# EAGLE design kctlspi (EAGLE 6.4)
AUTHOR_NAME: kps; PROJECT_NAME: Split keyboard; VERSION: 20130907
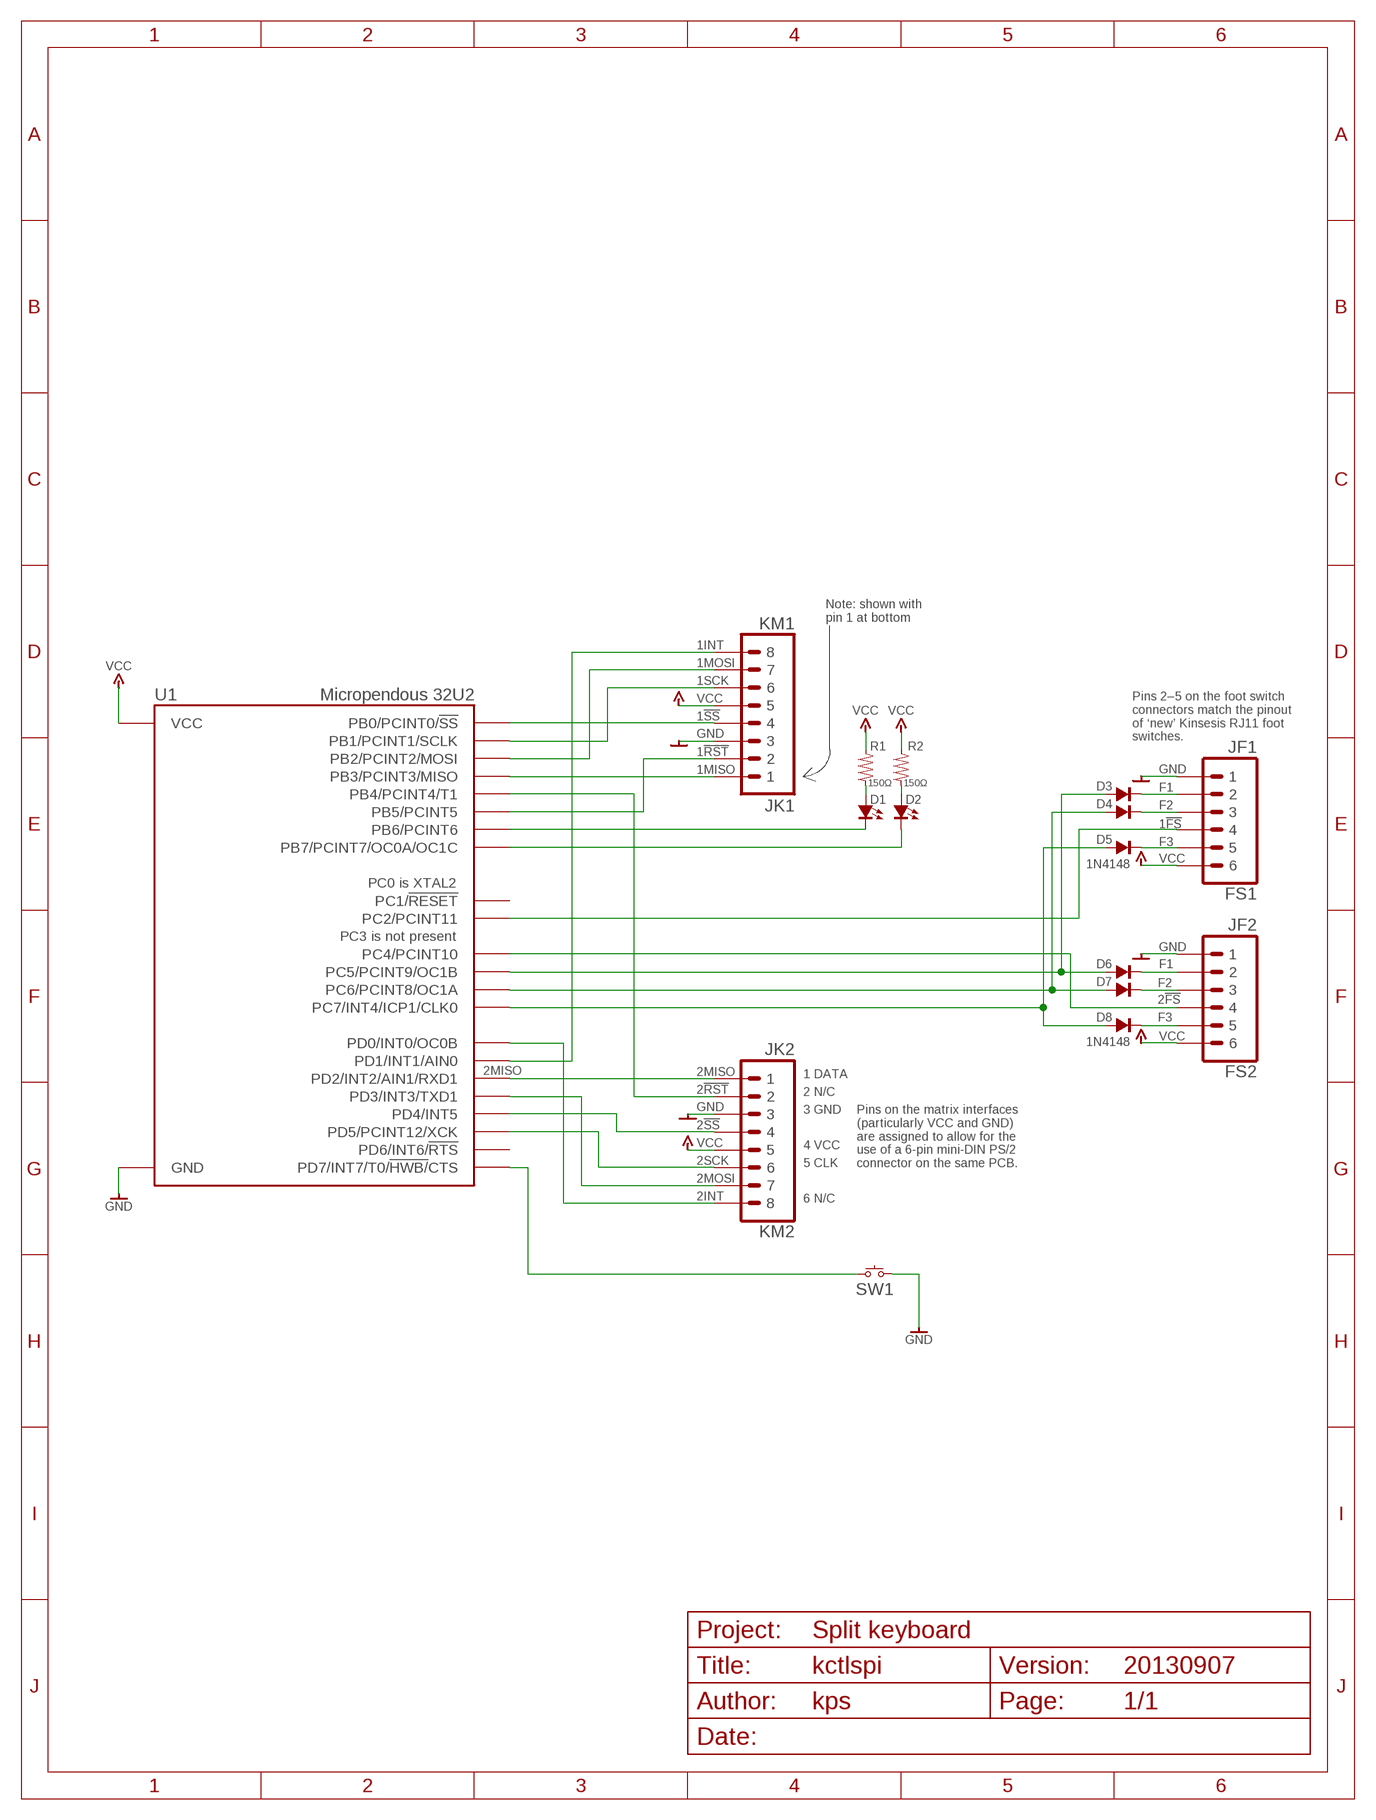
[diagram p0: schematic, sheet 1]

## Parts
D1  LED  [2H-100-P-EXTSS]
D2  LED  [2H-100-P-EXTSS]
D3  1N4148  DIODE-300-SMALLSS  [2H-300-P-SMALLSS]
D4  1N4148  DIODE-300-SMALLSS  [2H-300-P-SMALLSS]
D5  1N4148  DIODE-300-SMALLSS  [2H-300-P-SMALLSS]
D6  1N4148  DIODE-300-SMALLSS  [2H-300-P-SMALLSS]
D7  1N4148  DIODE-300-SMALLSS  [2H-300-P-SMALLSS]
D8  1N4148  DIODE-300-SMALLSS  [2H-300-P-SMALLSS]
JF1  FS1  J-6-RJ12-LP  [J-8-RJ12-TE5555163]
JF2  FS2  J-6-RJ12-LP  [J-8-RJ12-TE5555163]
JK1  KM1  J-8-SHIELD-MINIDIN  [J-8-MINIDIN-KMD11]
JK2  KM2  J-8-SHIELD-MINIDIN  [J-8-MINIDIN-KMD11]
R1  150Ω  RESISTOR-300  [2H-300-N-NOSS]
R2  150Ω  RESISTOR-300  [2H-300-N-NOSS]
SW1  SW-TACTILE-RA  [SW-TACTILE-RA]
U1  Micropendous 32U2  IC-ATMEGA32U2-NOOGROOVE  [IC-ATMEGA32U2-NOOGROOVE]

## Nets
1!FS: JF1.4 U1.PC2(PC2/PCINT11)
1!RST: JK1.2 U1.PB5(PB5/PCINT5)
1!SS: JK1.4 U1.PB0(PB0/PCINT0/!SS)
1INT: JK1.8 U1.PD1(PD1/INT1/AIN0)
1MISO: JK1.1 U1.PB3(PB3/PCINT3/MISO)
1MOSI: JK1.7 U1.PB2(PB2/PCINT2/MOSI)
1SCK: JK1.6 U1.PB1(PB1/PCINT1/SCLK)
2!FS: JF2.4 U1.PC4(PC4/PCINT10)
2!RST: JK2.2 U1.PB4(PB4/PCINT4/T1)
2!SS: JK2.4 U1.PD4(PD4/INT5)
2INT: JK2.8 U1.PD0(PD0/INT0/OC0B)
2MISO: JK2.1 U1.PD2(PD2/INT2/AIN1/RXD1)
2MOSI: JK2.7 U1.PD3(PD3/INT3/TXD1)
2SCK: JK2.6 U1.PD5(PD5/PCINT12/XCK)
F1: D3.A D6.A U1.PC5(PC5/PCINT9/OC1B)
F2: D4.A D7.A U1.PC6(PC6/PCINT8/OC1A)
F3: D5.A D8.A U1.PC7(PC7/INT4/ICP1/CLK0)
GND: JF1.1 JF2.1 JK1.3 JK2.3 SW1.2 U1.GND
LED1: D1.C U1.PB6(PB6/PCINT6)
LED2: D2.C U1.PB7(PB7/PCINT7/OC0A/OC1C)
N$1: SW1.1 U1.PD7(PD7/INT7/T0/!HWB/!CTS)
N$2: D3.C JF1.2
N$3: D4.C JF1.3
N$4: D5.C JF1.5
N$5: D8.C JF2.5
N$6: D7.C JF2.3
N$7: D6.C JF2.2
N$20: D2.A R2.1
N$21: D1.A R1.1
VCC: JF1.6 JF2.6 JK1.5 JK2.5 R1.2 R2.2 U1.+5V(VCC)
Unconnected: U1.PD6(PD6/INT6/!RTS) U1.RESET(PC1/!RESET)

## Notes on the sheet
- Note: shown with
  pin 1 at bottom
- Pins 2–5 on the foot switch
  connectors match the pinout
  of ‘new’ Kinsesis RJ11 foot
  switches.
- 1 DATA
- 2 N/C
- 3 GND
- 4 VCC
- 5 CLK
- Pins on the matrix interfaces
  (particularly VCC and GND)
  are assigned to allow for the
  use of a 6-pin mini-DIN PS/2
  connector on the same PCB.
- 6 N/C

## Power pins joined to a net without a drawn wire
GND: JK1.GND JK2.GND SW1.3(GND) SW1.4(GND)

## Library data of the parts
D1 D2 = misc:LED
D3-D8 = misc:DIODE
JF1 JF2 = conn:J-6: 6 pin connector
JK1 JK2 = conn:J-8-SHIELD
R1 R2 = misc:RESISTOR
SW1 = switch:SW-TACTILE-RA
U1 = ic:IC-ATMEGA32U2-NOOGROOVE: NooGroove ATmega32U2 development board.

## Board
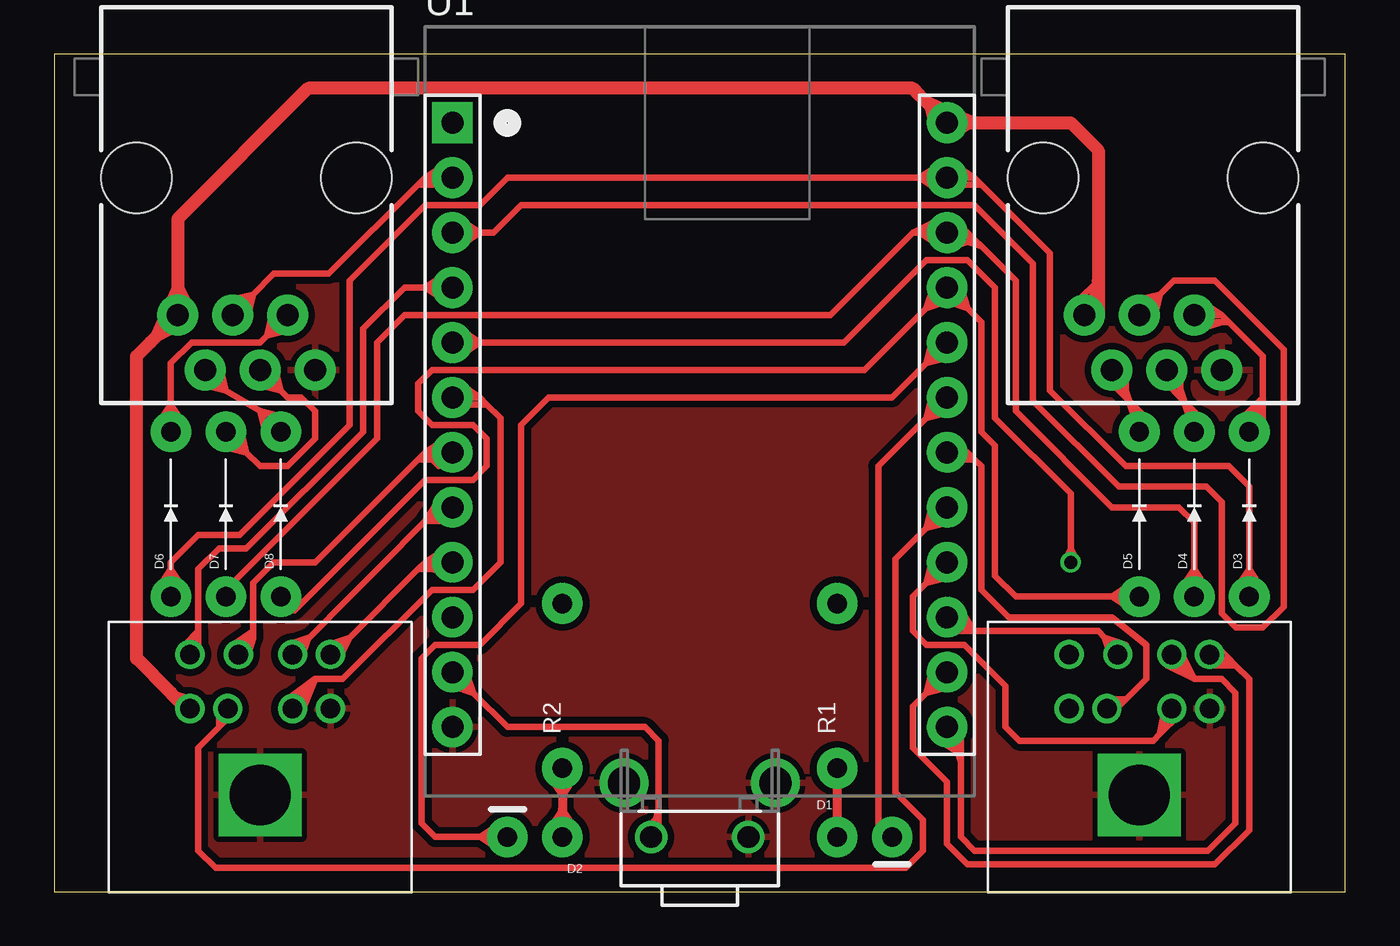
[diagram p1: board, top side]
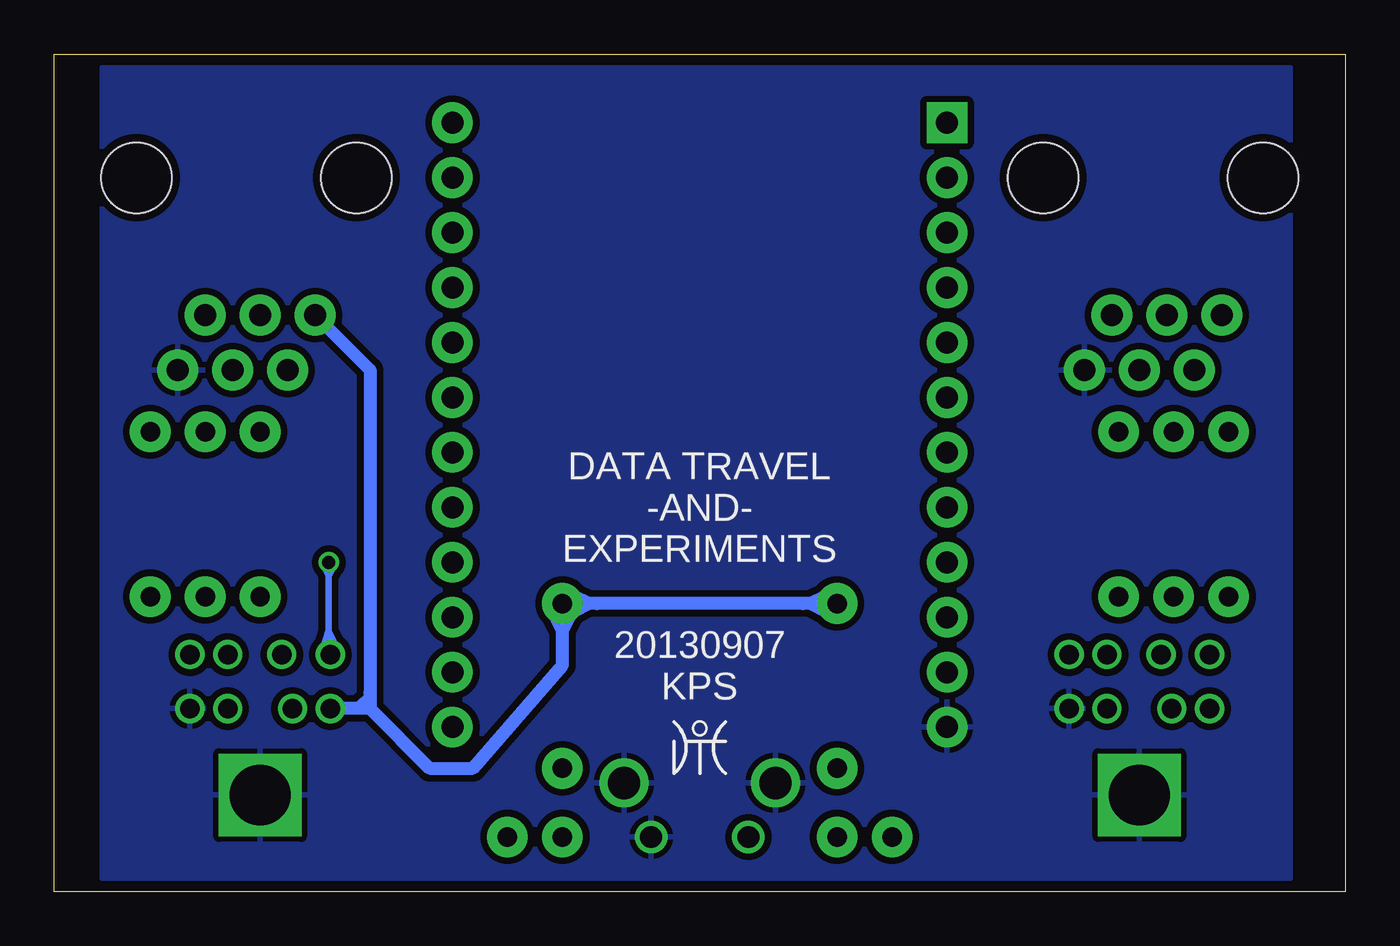
[diagram p2: board, bottom side, seen from below]

Size 59.69 x 38.73 mm. Coordinates in mm from the lower left corner, seen from the top.
Outline: 0,0 59.69,0 59.69,38.73 0,38.73 0,0
Copper layers (1*16): Top 0.0356mm / dielectric 1.5011mm / Bottom 0.0356mm
Design rules "LaenPCBOrder": minimum track width 6mil, minimum drill 13mil, track to track 6mil, track to pad 6mil, pad to pad 6mil, via to via 6mil, smd to smd 6mil, copper to edge 15mil, drill to drill 6mil, minimum pad ring 7mil, minimum via ring 7mil, stop-mask expansion 4mil, vias tented up to drill 0mil, thermal gap 10mil

### Footprints (pad centres in the part's own frame; a part is rotated, then mirrored left to right if it is on the bottom)
2H-100-P-EXTSS = drill 0.9 pad 1.88: A -1.27,0; C 1.27,0
2H-300-P-SMALLSS = drill 0.9 pad 1.88: A -3.81,0; C 3.81,0
J-8-RJ12-TE5555163 = drill 1.016 pad 1.88: 1 -3.175,7.62; 2 -1.905,5.08; 3 -0.635,7.62; 4 0.635,5.08; 5 1.905,7.62; 6 3.175,5.08 | hole 3.251: -5.08,-1.27; 5.08,-1.27
J-8-MINIDIN-KMD11 = drill 0.9: 1 1.5,0; 2 -1.5,0; 3 3.25,0; 4 1.5,2.5; 5 -3.25,0; 6 3.25,2.5; 7 -1,2.5; 8 -3.25,2.5 | drill 2.8 pad 3.81 square: GND 0,-4
2H-300-N-NOSS = drill 0.9 pad 1.88: 1 -3.81,0; 2 3.81,0
SW-TACTILE-RA = drill 1: 1 -2.25,-1.27; 2 2.25,-1.27 | drill 1.5: 3 -3.5,1.23; 4 3.5,1.23
IC-ATMEGA32U2-NOOGROOVE = drill 1.016 pad 1.88: +5V 11.43,13.97; GND -11.43,-13.97; PB0 11.43,-13.97; PB1 11.43,-11.43; PB2 11.43,-8.89; PB3 11.43,-6.35; PB4 11.43,-3.81; PB5 11.43,-1.27; PB6 11.43,1.27; PB7 11.43,3.81; PC2 -11.43,8.89; PC4 -11.43,11.43; PC5 11.43,11.43; PC6 11.43,8.89; PC7 11.43,6.35; PD0 -11.43,6.35; PD1 -11.43,3.81; PD2 -11.43,1.27; PD3 -11.43,-1.27; PD4 -11.43,-3.81; PD5 -11.43,-6.35; PD6 -11.43,-8.89; PD7 -11.43,-11.43 | drill 1.016 pad 1.88 square: RESET -11.43,13.97

### Placement (x,y rotation side)
D1  37.47,2.54 0 top
D2  22.23,2.54 180 top
D3  55.24,17.46 90 top
D4  52.7,17.46 90 top
D5  50.16,17.46 90 top
D6  5.4,17.46 90 top
D7  7.94,17.46 90 top
D8  10.48,17.46 90 top
JF1  50.8,31.75 180 top
JF2  8.89,31.75 180 top
JK1  50.16,8.48 0 top
JK2  9.53,8.48 0 top
R1  36.2,9.53 90 top
R2  23.5,9.53 90 top
SW1  29.84,3.81 0 top
U1  29.84,21.59 0 top
U$2  [GLYPH-DT&E-100]  29.84,6.67 0 bottom

### Tracks (layer width: path | path; a pad name or v marks a point on that pad's centre or on a via)
1!FS
  Top 0.305: JF1.4 51.12,27.62 | 51.12,27.62 51.75,28.26 53.66,28.26 56.83,25.08 56.83,13.18 55.88,12.22 54.63,12.22 53.98,12.88 53.98,18.02 53.27,18.73 49.21,18.73 45.24,22.7 45.24,29.05 42.55,31.75 21.59,31.75 20.32,30.48 19.68,30.48 | 19.68,30.48 U1.PC2 | 18.73,31.11 19.68,30.48 | 19.68,30.48 18.73,29.85 | 49.85,27.31 51.12,27.62 | 51.12,27.62 50.8,26.35
1!RST
  Top 0.305: JK1.2 48.9,8.25 49.53,8.89 | 49.53,8.89 50.48,9.84 50.48,11.43 48.9,12.7 44.13,12.7 42.86,13.97 42.86,19.68 42.55,20 | 42.55,20 42.23,20.32 | 42.23,20.32 U1.PB5 | 41.59,20.96 42.23,20.32 | 42.55,20 41.91,20 | 48.58,8.89 49.53,8.89
1!SS
  Top 0.305: 41.91,6.03 41.91,2.54 42.55,1.91 53.34,1.91 54.61,3.18 54.61,9.21 53.98,9.84 52.7,9.84 | 41.91,6.03 41.91,6.35 | 41.91,6.35 41.91,7.62 U1.PB0 | 40.96,6.99 41.91,6.35 | 41.59,6.99 41.91,6.03 | 52.7,9.84 51.44,10.48 51.44,10.75 JK1.4 | 52.7,9.84 52.07,11.11 52.07,10.48 52.7,9.84
1INT  (via drill 0.6)
  Top 0.305: U1.PD1 19.68,25.4 | 19.68,25.4 36.51,25.4 40.32,29.21 42.23,29.21 43.5,27.94 43.5,21.91 46.99,18.42 46.99,15.88 | 46.99,15.88 v46.99,15.24 | 18.73,24.77 19.68,25.4 | 19.68,25.4 18.73,26.04 | 46.67,15.24 46.99,15.88 | 46.99,15.88 47.31,15.24
  Bottom 0.305: JK1.8 46.99,11.11 46.99,12.07 | 46.99,12.07 46.99,14.61 | 46.99,14.61 v46.99,15.24 | 47.31,11.11 46.99,12.07 | 46.99,12.07 46.67,11.43 | 46.67,15.24 46.99,14.61 | 46.99,14.61 47.31,15.24
1MISO
  Top 0.305: U1.PB3 40.32,14.29 | 40.32,14.29 39.69,13.65 39.69,12.07 40.32,11.43 42.07,11.43 43.97,9.53 43.97,7.62 44.61,6.99 50.8,6.99 51.12,7.3 | 51.12,7.3 51.98,8.17 JK1.1 | 40.64,15.56 40.32,14.29 | 40.32,14.29 41.59,14.61 | 51.12,7.3 51.44,8.89 | 51.12,7.3 51.75,8.57
1MOSI
  Top 0.305: U1.PB2 41.91,12.07 | 41.91,12.07 42.23,12.07 | 42.23,12.07 42.55,12.07 | 42.55,12.07 48.26,12.07 48.58,11.75 | 48.58,11.75 49.16,11.16 JK1.7 | 41.27,12.07 41.91,12.07 | 42.55,12.07 41.91,13.02 42.23,12.07 | 49.53,11.43 48.58,11.75 | 48.58,11.75 48.9,10.79
1SCK
  Top 0.305: U1.PB1 40.32,9.21 | 40.32,9.21 39.69,8.57 39.69,6.67 41.27,5.08 41.27,2.22 42.23,1.27 53.66,1.27 55.24,2.86 55.24,9.84 54.61,10.48 | 54.61,10.48 54.29,10.79 | 54.29,10.79 53.79,11.29 JK1.6 | 40.64,10.48 40.32,9.21 | 40.32,9.21 41.59,9.53 | 54.61,10.48 53.34,10.48 54.29,10.79
2!FS
  Top 0.305: JF2.4 9.21,27.62 | 9.21,27.62 10.16,28.57 12.7,28.57 16.83,32.7 | 16.83,32.7 17.14,33.02 | 17.14,33.02 U1.PC4 | 7.94,27.31 9.21,27.62 | 9.21,27.62 8.89,26.35 | 18.1,32.39 17.14,33.02 | 17.14,33.02 18.1,33.66 | 16.83,32.7 17.78,32.7
2!RST
  Top 0.305: U1.PB4 40.32,16.83 | 40.32,16.83 38.89,15.4 38.89,4.6 40.16,3.33 40.16,1.91 39.37,1.11 7.46,1.11 6.67,1.91 6.67,6.67 7.62,7.62 | 7.62,7.62 8.26,8.25 JK2.2 | 7.62,8.57 7.62,7.62 | 40.64,18.1 40.32,16.83 | 40.32,16.83 41.59,17.14
2!SS
  Top 0.305: 17.78,17.78 JK2.4 10.79,11.21 10.79,11.43 11.75,11.75 11.43,10.79 | 17.78,17.78 U1.PD4 | 17.84,17.27 18.1,17.14 17.14,17.14 17.34,17.44 | 17.84,17.27 17.46,17.46 | 17.34,17.44 17.78,18.1 | 17.78,17.78 17.78,17.34 17.84,17.27 | 17.78,17.78 17.68,17.78 17.34,17.44
2INT
  Top 0.305: JK2.8 6.67,11.05 6.67,11.75 | 6.67,11.75 6.67,12.07 | 6.67,12.07 6.67,14.92 7.62,15.88 8.89,15.88 14.29,21.27 14.29,26.04 16.19,27.94 17.14,27.94 | 17.14,27.94 U1.PD0 | 6.67,12.07 6.03,11.43 6.67,11.75 | 18.1,27.31 17.14,27.94 | 17.14,27.94 18.1,28.57
2MISO
  Top 0.305: 20,22.54 20.64,21.91 20.64,15.24 19.37,13.97 17.46,13.97 13.34,9.84 12.06,9.84 | 20,22.54 19.68,22.86 | 19.68,22.86 U1.PD2 | 12.06,9.84 10.79,8.89 10.79,8.71 JK2.1 | 12.06,9.84 11.43,8.25 11.11,8.57 12.06,9.84 | 18.73,23.5 19.68,22.86 | 20,22.54 19.05,22.54
2MOSI
  Top 0.305: JK2.7 8.89,10.71 9.21,11.75 | 9.21,11.75 9.21,12.07 | 9.21,12.07 9.21,14.29 10.16,15.24 12.06,15.24 16.83,20 | 16.83,20 17.14,20.32 | 17.14,20.32 U1.PD3 | 9.21,12.07 8.26,11.43 9.21,11.75 | 9.21,11.75 8.57,11.11 | 17.78,19.68 17.14,20.32 | 17.14,20.32 18.1,20.96 | 16.83,20 17.78,20
2SCK
  Top 0.305: JK2.6 13.02,11.11 13.65,11.75 | 13.65,11.75 16.83,14.92 | 16.83,14.92 17.14,15.24 | 12.7,11.43 13.65,11.75 | 13.65,11.75 13.34,11.11 | 17.14,15.24 18.1,15.88 | 16.83,14.92 17.46,14.92 | 17.46,14.92 17.78,14.92 | 17.14,15.24 U1.PD5 | 18.41,14.61 17.46,14.92
F1
  Top 0.305: D6.A 5.4,14.92 | 5.4,14.92 5.4,15.24 6.67,16.51 8.57,16.51 13.65,21.59 13.65,28.26 17.14,31.75 19.68,31.75 20.95,33.02 40.01,33.02 | 40.01,33.02 U1.PC5 42.55,33.02 | D3.A 55.24,14.92 | 55.24,14.92 55.24,18.73 54.29,19.68 49.53,19.68 46.04,23.18 46.04,29.53 42.86,32.7 | 42.86,32.7 42.55,33.02 | 4.76,13.97 5.4,14.92 | 5.4,14.92 6.03,13.97 | 40.96,32.39 40.01,33.02 | 40.01,33.02 40.96,33.66 | 41.59,33.66 42.55,33.02 | 41.91,32.7 42.86,32.7 | 54.61,13.97 55.24,14.92 | 55.24,14.92 55.88,13.97
F2
  Top 0.305: D7.A 8.26,14.29 14.92,20.96 14.92,25.4 16.19,26.67 35.88,26.67 39.69,30.48 | 39.69,30.48 40.01,30.48 | 40.01,30.48 U1.PC6 42.23,30.48 | 42.86,29.85 44.45,28.26 44.45,22.23 48.9,17.78 51.99,17.78 52.7,17.07 52.7,14.92 | 42.86,29.85 42.55,30.16 | 42.55,30.16 42.23,30.48 | 52.7,14.92 D4.A | 40.96,31.11 39.69,30.48 | 40.01,30.48 40.96,29.85 | 42.23,30.48 41.59,31.11 | 41.59,29.85 42.55,30.16 | 42.55,30.16 41.91,30.16 42.86,29.85 | 52.07,13.97 52.7,14.92 | 52.7,14.92 53.34,13.97
F3
  Top 0.305: D8.A 11.11,13.02 17.14,19.05 19.37,19.05 20,19.68 20,20.96 19.37,21.59 17.46,21.59 16.83,22.23 16.83,23.5 17.46,24.13 37.47,24.13 40.32,26.99 | 40.32,26.99 U1.PC7 42.23,26.99 | D5.A 48.9,13.65 | 48.9,13.65 44.45,13.65 43.5,14.61 43.5,20.64 42.86,21.27 42.86,26.35 42.23,26.99 | 40.64,27.94 40.32,26.99 | 40.32,26.99 41.27,27.31 42.23,26.99 | 42.23,26.99 41.91,27.94 | 49.85,14.29 48.9,13.65 | 48.9,13.65 49.85,13.02
GND
  pour Bottom (isolate 0.305): 2.54,0.64 2.54,38.1 57.47,38.1 57.47,0.64
  pour Top (isolate 0.305): 2.54,0.64 2.54,38.1 57.47,38.1 57.47,0.64
LED1
  Top 0.305: U1.PB6 40.32,21.91 | 40.32,21.91 38.1,19.68 38.1,2.54 D1.C | 40.64,23.18 40.32,21.91 | 40.32,21.91 41.59,22.23
LED2
  Top 0.305: U1.PB7 40.32,24.45 | 40.32,24.45 38.73,22.86 22.86,22.86 21.59,21.59 21.59,13.34 19.68,11.43 17.62,11.43 16.99,10.79 16.99,3.18 17.62,2.54 19.68,2.54 | 19.68,2.54 D2.C | 20.64,1.91 19.68,2.54 | 19.68,2.54 20.64,3.18 | 40.64,25.72 40.32,24.45 | 40.32,24.45 41.59,24.77
N$1
  Top 0.305: SW1.1 27.94,2.89 27.94,3.49 | 27.94,3.49 27.94,3.81 | 27.94,3.81 27.94,6.99 27.3,7.62 20.95,7.62 19.37,9.21 | 19.37,9.21 U1.PD7 | 27.94,3.81 27.62,2.54 27.3,2.86 27.94,3.49 | 18.41,9.53 19.37,9.21 | 19.37,9.21 19.05,10.16
N$2
  Top 0.305: JF1.2 53.98,26.67 | 53.98,26.67 54.29,26.35 | 54.29,26.35 55.88,24.77 55.88,22.86 | 55.88,22.86 55.88,22.54 | 55.88,22.54 55.88,22.23 | 55.88,22.23 55.88,21.27 D3.C | 53.02,27.31 53.98,26.67 | 54.29,26.35 53.98,26.35 | 53.98,26.35 53.34,26.35 | 53.98,26.35 53.02,26.04 | 54.93,21.91 55.88,22.86 | 55.88,22.54 55.24,21.91 55.88,22.23
N$3
  Top 0.305: 52.07,22.86 53.34,21.59 53.02,21.27 D4.C 51.75,24.13 JF1.3 51.44,23.5 52.07,22.86 | 52.07,24.13 52.07,22.86
N$4
  Top 0.305: 49.53,22.86 50.8,21.59 50.48,21.27 D5.C 49.21,24.13 JF1.5 48.9,23.5 49.53,22.86 | 49.53,24.13 49.53,22.86
N$5
  Top 0.305: D8.C 9.53,22.23 | 9.53,22.23 7.94,23.18 | 7.94,23.18 JF2.5 | 6.67,23.5 7.94,23.18 | 7.94,23.18 7.62,24.45 | 10.79,21.91 9.53,22.23 | 9.53,22.23 9.84,20.96
N$6
  Top 0.305: D7.C 8.89,20.32 | 8.89,20.32 9.53,19.68 10.79,19.68 12.06,20.96 12.06,22.23 11.43,22.86 10.79,22.86 10.48,23.18 | 10.48,23.18 JF2.3 | 9.21,23.5 10.48,23.18 | 10.48,23.18 10.16,24.45 | 7.62,20.64 8.89,20.32 | 8.89,20.32 8.57,21.59
N$7
  Top 0.305: JF2.2 9.84,25.72 | 9.84,25.72 9.53,25.4 6.35,25.4 5.4,24.45 5.4,22.54 | 5.4,22.54 D6.C | 10.16,26.99 9.84,25.72 | 9.84,25.72 11.11,26.04 | 4.76,21.59 5.4,22.54 | 5.4,22.54 6.03,21.59
N$20
  Top 0.305: 22.86,2.86 23.5,3.81 24.13,2.86 | 22.86,5.4 23.5,4.45 24.13,5.4
  Top 0.406: R2.1 23.5,4.45 23.5,3.81 D2.A
N$21
  Top 0.406: R1.1 D1.A
VCC
  Top 0.305: 6.28,8.33 JK2.5 6.13,8.48 | 6.35,26.99 5.71,28.26 4.45,25.4 5.71,26.04 | 5.4,9.21 6.35,8.89 | 40.64,35.24 40.32,36.51 | 42.86,35.56 40.01,36.83 | 41.59,34.93 42.55,35.56 | 47.31,27.31 48.26,28.26 JF1.6
  Top 0.61: 6.13,8.48 5.4,9.21 3.81,10.79 3.81,24.77 4.45,25.4 JF2.6 5.71,28.26 5.71,31.11 11.75,37.15 39.69,37.15 40.01,36.83 40.32,36.51 U1.+5V 42.55,35.56 42.86,35.56 46.99,35.56 48.26,34.29 48.26,28.26 48.26,26.67 JF1.6
  Bottom 0.305: 23.81,13.97 25.08,13.34 23.81,12.7 | 35.88,13.97 34.61,13.34 35.88,12.7 | 35.56,13.02 36.2,11.75 36.83,13.02 | 45.09,9.21 45.72,8.57
  Bottom 0.61: 45.09,8.48 JK1.5 | JF1.6 45.09,24.13 45.09,9.21 45.09,8.48 | R2.2 25.08,13.34 34.61,13.34 R1.2 36.2,11.75 36.2,10.48 40.32,5.71 42.32,5.71 45.09,8.48

### Text on the board
bPlace: DATA TRAVEL / -AND- / EXPERIMENTS | 20130907 / KPS